# EAGLE design FlightComputer (EAGLE 9.0.1)
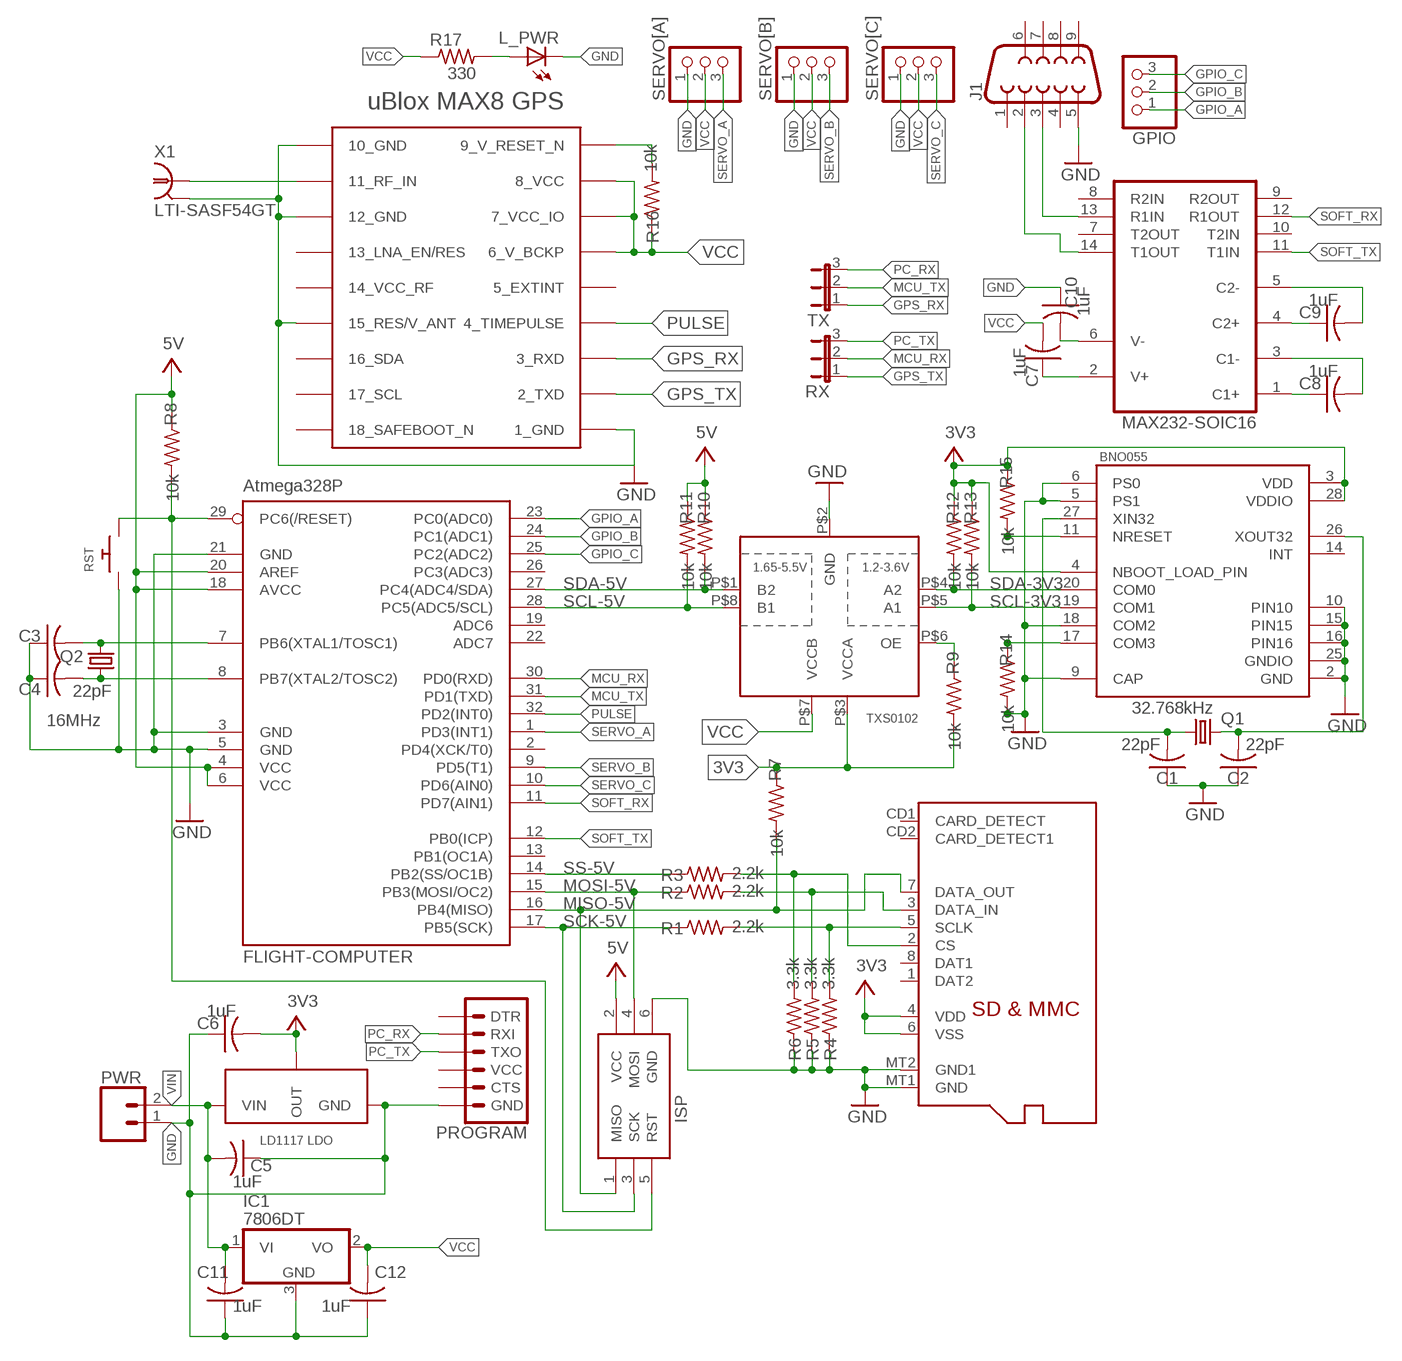
[diagram p0: schematic, sheet 1]

## Parts
BNO055  BNO055  [LGA28R50P4X10_380X520X100]
C1  22pF  C-USC0805  [C0805]
C2  22pF  C-USC0805  [C0805]
C3  22pF  C-USC0805  [C0805]
C4  22pF  C-USC0805  [C0805]
C5  1uF  C-USC0805  [C0805]
C6  1uF  C-USC0805  [C0805]
C7  1uF  C-USC0805  [C0805]
C8  1uF  C-USC0805  [C0805]
C9  1uF  C-USC0805  [C0805]
C10  1uF  C-USC0805  [C0805]
C11  1uF  C-USC0805  [C0805]
C12  1uF  C-USC0805  [C0805]
FLIGHT-COMPUTER  Atmega328P  MEGA8-AI  [TQFP32-08]
GPIO  PINHD-1X3  [1X03]
IC1  7806DT  [TO252]
ISP  AVRISP-BOX  [AVRISP-BOX]
J1  DB9MALE  [DB9_MALE]
L_PWR  LEDSML0805  [SML0805]
MAX232-SOIC16  MAX232ECWE  [SO16L]
PROGRAM  6_PIN_SERIAL_TARGETSILK  [6_PIN_SERIAL_TARGET_SIDE_W_SILK]
PWR  CONN_02  [1X02]
Q1  32.768kHz  CRYSTALHC49S  [HC49/S]
Q2  16MHz  CRYSTALHC49S  [HC49/S]
R1  2.2k  R-US_R0805  [R0805]
R2  2.2k  R-US_R0805  [R0805]
R3  2.2k  R-US_R0805  [R0805]
R4  3.3k  R-US_R0805  [R0805]
R5  3.3k  R-US_R0805  [R0805]
R6  3.3k  R-US_R0805  [R0805]
R7  10k  R-US_R0805  [R0805]
R8  10k  R-US_R0805  [R0805]
R9  10k  R-US_R0805  [R0805]
R10  10k  R-US_R0805  [R0805]
R11  10k  R-US_R0805  [R0805]
R12  10k  R-US_R0805  [R0805]
R13  10k  R-US_R0805  [R0805]
R14  10k  R-US_R0805  [R0805]
R15  10k  R-US_R0805  [R0805]
R16  10k  R-US_R0805  [R0805]
R17  330  R-US_R0805  [R0805]
RST  SWITCH_PUSHBUTTONEVQ-PE  [TACT_PANA-EVQ]
RX  JP2E  [JP2]
SD-CARD  MICROSD  [MICROSD]
SERVO[A]  PINHD-1X3  [1X03]
SERVO[B]  PINHD-1X3  [1X03]
SERVO[C]  PINHD-1X3  [1X03]
TX  JP2E  [JP2]
TXS0102  TXS0102  [VFSOP-8]
U$1  MAX-M8  [MAX-M8]
U$2  LD1117  [LD1117]
X1  LTI-SASF54GT  [LTI-SASF54GT]

## Nets
3V3: BNO055.3(VDD) BNO055.4(NBOOT_LOAD_PIN) BNO055.28(VDDIO) C6.2 R7.1 R9.2 R12.1 R13.1 R15.1 SD-CARD.4(VDD) SD-CARD.6(VSS) TXS0102.P$3(VCCA) U$2.OUT U$2.PAD(OUT)
BNO_RST_3V3: BNO055.11(NRESET) R15.2
GND: BNO055.2(GND) BNO055.5(PS1) BNO055.6(PS0) BNO055.9(CAP) BNO055.10(PIN10) BNO055.15(PIN15) BNO055.16(PIN16) BNO055.18(COM2) BNO055.25(GNDIO) C1.1 C2.1 C3.1 C4.1 C5.1 C6.1 C10.1 C11.1 C12.1 FLIGHT-COMPUTER.3(GND) FLIGHT-COMPUTER.5(GND) FLIGHT-COMPUTER.21(GND) IC1.3(GND) ISP.6(GND) J1.5 L_PWR.C PROGRAM.P$6(GND) PWR.1 R4.1 R5.1 R6.1 R14.2 RST.P$1 SD-CARD.MT1(GND) SD-CARD.MT2(GND1) SERVO[A].1 SERVO[B].1 SERVO[C].1 TXS0102.P$2(GND) U$2.GND
GPIO_A: FLIGHT-COMPUTER.23(PC0(ADC0)) GPIO.1
GPIO_B: FLIGHT-COMPUTER.24(PC1(ADC1)) GPIO.2
GPIO_C: FLIGHT-COMPUTER.25(PC2(ADC2)) GPIO.3
GPS_RX: TX.1 U$1.3_RXD
GPS_TX: RX.1 U$1.2_TXD
MCU_RX: FLIGHT-COMPUTER.30(PD0(RXD)) RX.2
MCU_TX: FLIGHT-COMPUTER.31(PD1(TXD)) TX.2
MISO-5V: FLIGHT-COMPUTER.16(PB4(MISO)) ISP.1(MISO) R7.2 SD-CARD.7(DATA_OUT)
MOSI-5V: FLIGHT-COMPUTER.15(PB3(MOSI/OC2)) ISP.4(MOSI) R2.1
N$1: C4.2 FLIGHT-COMPUTER.8(PB7(XTAL2/TOSC2)) Q2.1
N$2: C3.2 FLIGHT-COMPUTER.7(PB6(XTAL1/TOSC1)) Q2.2
N$3: R9.1 TXS0102.P$6(OE)
N$4: U$1.11_RF_IN X1.1
N$5: BNO055.17(COM3) R14.1
N$6: BNO055.27(XIN32) C1.2 Q1.1
N$7: R16.2 U$1.9_RESET_N(9_V_RESET_N)
N$8: FLIGHT-COMPUTER.29(PC6(/RESET)) ISP.5(RST) R8.2 RST.P$2
N$9: BNO055.26(XOUT32) C2.2 Q1.2
N$10: J1.3 MAX232-SOIC16.13(R1IN)
N$11: U$1.1_GND U$1.10_GND U$1.12_GND U$1.15_V_ANT/RESERVED(15_RES/V_ANT) X1.2 X1.3 X1.4 X1.5
N$14: J1.2 MAX232-SOIC16.14(T1OUT)
N$15: L_PWR.A R17.2
N$16: C7.1 MAX232-SOIC16.2(V+)
N$17: C8.1 MAX232-SOIC16.1(C1+)
N$18: C8.2 MAX232-SOIC16.3(C1-)
N$19: C9.1 MAX232-SOIC16.4(C2+)
N$20: C9.2 MAX232-SOIC16.5(C2-)
N$21: C10.2 MAX232-SOIC16.6(V-)
PC_RX: PROGRAM.P$3(RXI) TX.3
PC_TX: PROGRAM.P$2(TXO) RX.3
PULSE: FLIGHT-COMPUTER.32(PD2(INT0)) U$1.4_TIMEPULSE
SCK-5V: FLIGHT-COMPUTER.17(PB5(SCK)) ISP.3(SCK) R1.1
SCL-3V3: BNO055.19(COM1) R13.2 TXS0102.P$5(A1)
SCL-5V: FLIGHT-COMPUTER.28(PC5(ADC5/SCL)) R11.2 TXS0102.P$8(B1)
SD_CS: R3.2 R6.2 SD-CARD.2(CS)
SD_MOSI: R2.2 R5.2 SD-CARD.3(DATA_IN)
SD_SCK: R1.2 R4.2 SD-CARD.5(SCLK)
SDA-3V3: BNO055.20(COM0) R12.2 TXS0102.P$4(A2)
SDA-5V: FLIGHT-COMPUTER.27(PC4(ADC4/SDA)) R10.2 TXS0102.P$1(B2)
SERVO_A: FLIGHT-COMPUTER.1(PD3(INT1)) SERVO[A].3
SERVO_B: FLIGHT-COMPUTER.9(PD5(T1)) SERVO[B].3
SERVO_C: FLIGHT-COMPUTER.10(PD6(AIN0)) SERVO[C].3
SOFT_RX: FLIGHT-COMPUTER.11(PD7(AIN1)) MAX232-SOIC16.12(R1OUT)
SOFT_TX: FLIGHT-COMPUTER.12(PB0(ICP)) MAX232-SOIC16.11(T1IN)
SS-5V: FLIGHT-COMPUTER.14(PB2(SS/OC1B)) R3.1
VCC: C7.2 C12.2 FLIGHT-COMPUTER.4(VCC) FLIGHT-COMPUTER.6(VCC) FLIGHT-COMPUTER.18(AVCC) FLIGHT-COMPUTER.20(AREF) IC1.2(VO) ISP.2(VCC) R8.1 R10.1 R11.1 R16.1 R17.1 SERVO[A].2 SERVO[B].2 SERVO[C].2 TXS0102.P$7(VCCB) U$1.6_V_BCKP U$1.7_VCC_IO U$1.8_VCC ; supply symbol labelled 5V
VIN: C5.2 C11.2 IC1.1(VI) PWR.2 U$2.IN(VIN)
Unconnected: BNO055.14(INT) FLIGHT-COMPUTER.2(PD4(XCK/T0)) FLIGHT-COMPUTER.13(PB1(OC1A)) FLIGHT-COMPUTER.19(ADC6) FLIGHT-COMPUTER.22(ADC7) FLIGHT-COMPUTER.26(PC3(ADC3)) J1.1 J1.4 J1.6 J1.7 J1.8 J1.9 MAX232-SOIC16.7(T2OUT) MAX232-SOIC16.8(R2IN) MAX232-SOIC16.9(R2OUT) MAX232-SOIC16.10(T2IN) PROGRAM.P$1(DTR) PROGRAM.P$4(VCC) PROGRAM.P$5(CTS) SD-CARD.1(DAT2) SD-CARD.8(DAT1) SD-CARD.CD1(CARD_DETECT) SD-CARD.CD2(CARD_DETECT1) U$1.5_EXTINT U$1.13_LNA_EN(13_LNA_EN/RES) U$1.14_VCC_RF U$1.16_SDA U$1.17_SCL U$1.18_SAFEBOOT_N

## Notes on the sheet
- uBlox MAX8 GPS

## Power pins joined to a net without a drawn wire
GND: MAX232-SOIC16.15(GND)
VCC: MAX232-SOIC16.16(VCC)

## Library data of the parts
BNO055 = BNO055:BNO055: BNO055 9-axis Absolute Orientation Sensor ( SiP ) w/Sensors and Sensor Fusion; AVAILABILITY: Good; DESCRIPTION: BNO055 9-axis Absolute Orientation Sensor _ SiP _ w/Sensors and Sensor Fusion; MF: Bosch; MP: BNO055; PACKAGE: LGA-28 Bosch; PRICE: 8.04 USD
C1-C12 = adafruit:C-US: CAPACITOR, American symbol
FLIGHT-COMPUTER = atmel:MEGA8: MICROCONTROLLER 8 Kbytes FLASH, 1 kbytes SRAM, 512 bytes EEPROM, USART, 6-channel 10 bit ADC, 2-channel 8 bit ADC Pin compatible with Atmega48, ATMega88, ATMega168 Source: avr.lbr; MPN: ATMEGA8-16AU; OC_FARNELL: 9171371; OC_NEWARK: 73M8863
GPIO SERVO[A] SERVO[B] SERVO[C] = adafruit:PINHD-1X3: PIN HEADER
IC1 = adafruit:78*: Positive VOLTAGE REGULATOR Added bigger pads to the TO-92 package
ISP = adafruit:AVRISP: AVR ISP HEADER Standard 6 pin header for AVR programming
J1 = SparkFun-Connectors:DB9: DB9 Connector Standard DB9 (D-Sub 9) serial connector. Can be used for CAN bus as well as RS485 and RS232. Footprint production proven. Here is the female version connector we sell at SparkFun: 9 Pin Female Serial Connector - PCB Mount <https://www.sparkfun.com/products/429> (PRT-00429) This connector has been used on the following SparkFun products: SparkFun RS232 Shifter - SMD <https://www.sparkfun.com/products/449> (PRT-00449) SparkFun RS232 Shifter SMD (No DB9) <https://www.sparkfun.com/products/8780> (PRT-08780); PROD_ID: CONN-09904
L_PWR = led:LED: LED OSRAM: - CHIPLED LG R971, LG N971, LY N971, LG Q971, LY Q971, LO R971, LY R971 LH N974, LH R974 LS Q976, LO Q976, LY Q976 LO Q996 - Hyper CHIPLED LW Q18S LB Q993, LB Q99A, LB R99A - SideLED LS A670, LO A670, LY A670, LG A670, LP A670 LB A673, LV A673, LT A673, LW A673 LH A674 LY A675 LS A676, LA A676, LO A676, LY A676, LW A676 LS A679, LY A679, LG A679 - Hyper Micro SIDELED® LS Y876, LA Y876, LO Y876, LY Y876 LT Y87S - SmartLED LW L88C, LW L88S LB L89C, LB L89S, LG L890 LS L89K, LO L89K, LY L89K LS L896, LA L896, LO L896, LY L896 - TOPLED LS T670, LO T670, LY T670, LG T670, LP T670 LSG T670, LSP T670, LSY T670, LOP T670, LYG T670 LG T671, LOG T671, LSG T671 LB T673, LV T673, LT T673, LW T673 LH T674 LS T676, LA T676, LO T676, LY T676, LB T676, LH T676, LSB T676, LW T676 LB T67C, LV T67C, LT T67C, LS T67K, LO T67K, LY T67K, LW E67C LS E67B, LA E67B, LO E67B, LY E67B, LB E67C, LV E67C, LT E67C LW T67C LS T679, LY T679, LG T679 LS T770, LO T770, LY T770, LG T770, LP T770 LB T773, LV T773, LT T773, LW T773 LH T774 LS E675, LA E675, LY E675, LS T675 LS T776, LA T776, LO T776, LY T776, LB T776 LHGB T686 LT T68C, LB T68C - Hyper Mini TOPLED® LB M676 - Mini TOPLED Santana® LG M470 LS M47K, LO M47K, LY M47K Source: http://www.osram.convergy.de LUXEON: - LUMILED® LXK2-PW12-R00, LXK2-PW12-S00, LXK2-PW14-U00, LXK2-PW14-V00 LXK2-PM12-R00, LXK2-PM12-S00, LXK2-PM14-U00 LXK2-PE12-Q00, LXK2-PE12-R00, LXK2-PE12-S00, LXK2-PE14-T00, LXK2-PE14-U00 LXK2-PB12-K00, LXK2-PB12-L00, LXK2-PB12-M00, LXK2-PB14-N00, LXK2-PB14-P00, LXK2-PB14-Q00 LXK2-PR12-L00, LXK2-PR12-M00, LXK2-PR14-Q00, LXK2-PR14-R00 LXK2-PD12-Q00, LXK2-PD12-R00, LXK2-PD12-S00 LXK2-PH12-R00, LXK2-PH12-S00 LXK2-PL12-P00, LXK2-PL12-Q00, LXK2-PL12-R00 Source: www.luxeon.com KINGBRIGHT: KA-3528ASYC Source: www.kingbright.com
MAX232-SOIC16 = maxim:MAX232ECWE: RS232 TRANSCEIVER; MF: MAXIM; MPN: MAX232ECWE+; OC_FARNELL: 9724435; OC_NEWARK: 67K4440
PROGRAM = SparkFun-Connectors:6_PIN_SERIAL_TARGET: 6-pin header connection for use with the "FTDI BASIC" pinout - TARGET SIDE. Also known as "Arduino Serial Program Header". It is used to mate with our FTDI Basic serial programmers using the Arduino IDE. Note, this device has "TARGET" in the name. It is intended to be used on a design that contains a target micro-controller that you wish to program. The "sister" device, named "CABLE" is inteneded to be used on a design that usually lives on the end of your USB cable and prvides the converter chip (FTDI232 or FTDI231x) to commnicate serial RX/TX. You can populate with some of these: Break Away Headers - Straight <https://www.sparkfun.com/products/116> (PRT-00116) For reference (or to suit your programming needs) check out these designs: SparkFun FTDI Basic Breakout - 5V <https://www.sparkfun.com/products/9716> (DEV-09716) SparkFun FTDI Basic Breakout - 3.3V <https://www.sparkfun.com/products/9873> (DEV-09873) SparkFun FTDI SmartBasic <https://www.sparkfun.com/products/12935> (DEV-12935) SparkFun Beefy 3 - FTDI Basic Breakout <https://www.sparkfun.com/products/13746> (DEV-13746)
PWR = SparkFun-Connectors:CONN_02: Multi connection point. Often used as Generic Header-pin footprint for 0.1 inch spaced/style header connections On any of the 0.1 inch spaced packages, you can populate with these: Break Away Headers - Straight <https://www.sparkfun.com/products/116> (PRT-00116) Break Away Male Headers - Right Angle <https://www.sparkfun.com/products/553> (PRT-00553) Female Headers <https://www.sparkfun.com/products/115> (PRT-00115) Break Away Headers - Machine Pin <https://www.sparkfun.com/products/117> (PRT-00117) Break Away Female Headers - Swiss Machine Pin <https://www.sparkfun.com/products/743> (PRT-00743) For SCREWTERMINALS and SPRING TERMINALS visit here: Screw Terimnals on SparkFun.com <https://www.sparkfun.com/search/results?term=Screw+Terminals> (5mm/3.5mm/2.54mm spacing) This device is also useful as a general connection point to wire up your design to another part of your project. Our various solder wires solder well into these plated through hole pads. Hook-Up Wire - Assortment (Stranded, 22 AWG) <https://www.sparkfun.com/products/11375> (PRT-11375) Hook-Up Wire - Assortment (Solid Core, 22 AWG) <https://www.sparkfun.com/products/11367> (PRT-11367) View the entire wire category on our website here <https://www.sparkfun.com/categories/141> Special notes: Molex polarized connector foot print use with: PRT-08233 with associated crimp pins and housings. 2.54_SCREWTERM for use with PRT-10571. 3.5mm Screw Terminal footprints for PRT-08084 5mm Screw Terminal footprints for use with PRT-08432
Q1 Q2 = adafruit:CRYSTAL: CRYSTAL; OC_FARNELL: 1667008; OC_NEWARK: unknown
R1-R17 = adafruit:R-US_: RESISTOR, American symbol
RST = adafruit:SWITCH_PUSHBUTTON: Buttons SOFTTOUCHSMD_SJ - Soft touch temporary push button (Super Junk Akihabara) Compatible with SKPMANE010 [Mouser: 688-SKPMAN] C&K_KSS = Digikey: KSS221GLFS
RX TX = jumper:JP2E: JUMPER
SD-CARD = adafruit:MICROSD: Micro-SD / Transflash card holder with SPI pinout For the 3M # 2908-05WB-MG and/or 4UCON #19656 push-push type
TXS0102 = adafruit:TXS0102: 2-Bit Bi-Directional Level Shifter (I2C, etc.) Designed for I2C devices and has internal pullups. Not to be confused with TXB010x series. 1.2V-3.6V (VCCA) to 1.65V-5.5V (VCCB) bi-directional level shifter with auto direction sensing. Max data rate - 24Mbps (Push Pull), 2Mbps (Open Drain) Digikey: 296-21931-1-ND
U$1 = ubloxLib:MAX-M8: u-blox MAX GNSS module
U$2 = ReconfigBoard_Parts:LD1117: StMicroeletronics LD1117; in DPAK Configuration. Various Fixed Voltage Levels, LDO Type. By Kenneth Vorseth.
X1 = con-coax:LTI-SASF54GT: SMA vertical PCB thrue hole jack Source: Lighthorse Technologies, inc. SASF54GT.pdf; OC_FARNELL: unknown; OC_NEWARK: unknown

## Board
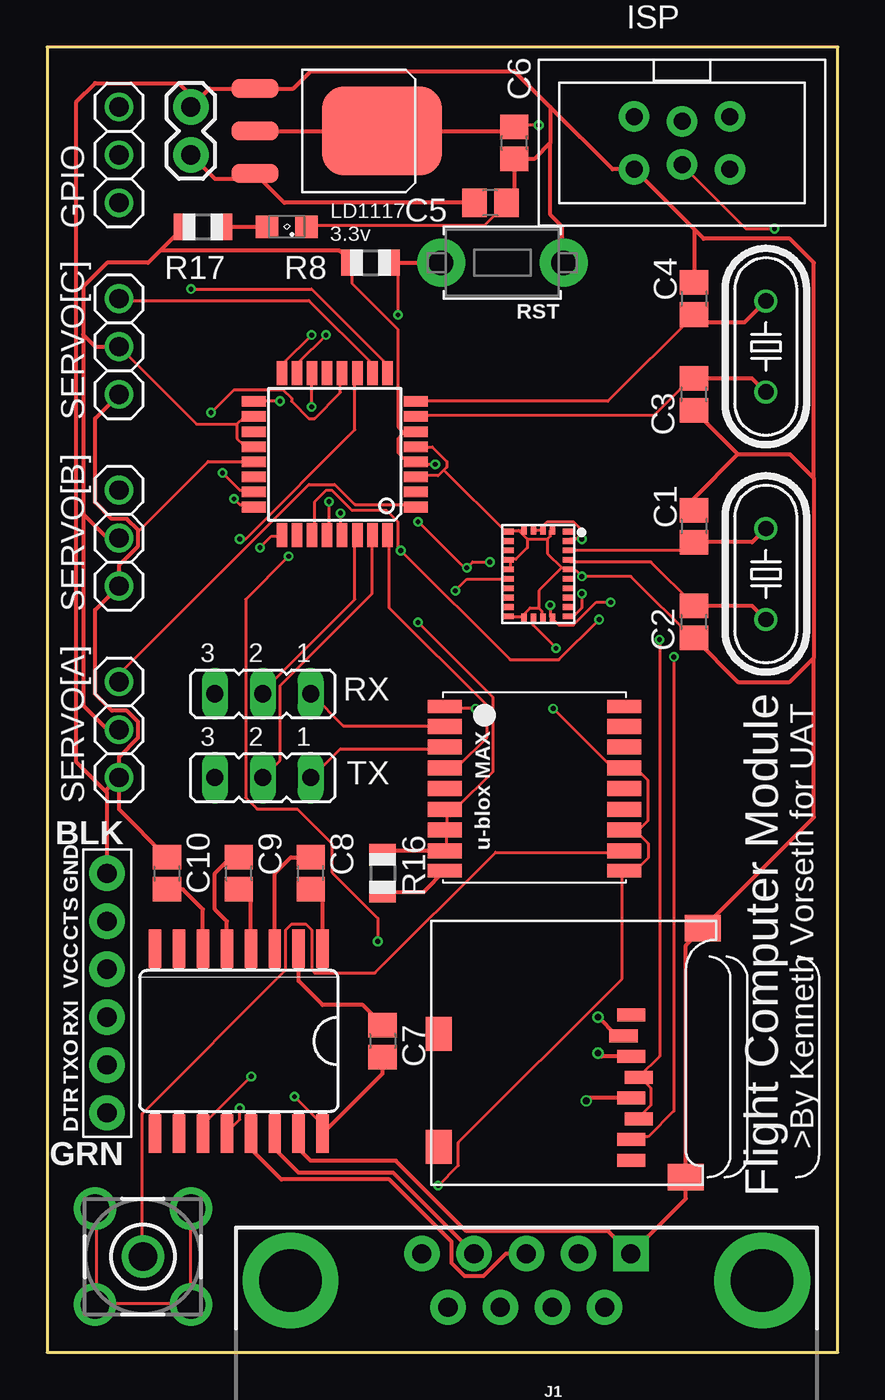
[diagram p1: board, top side]
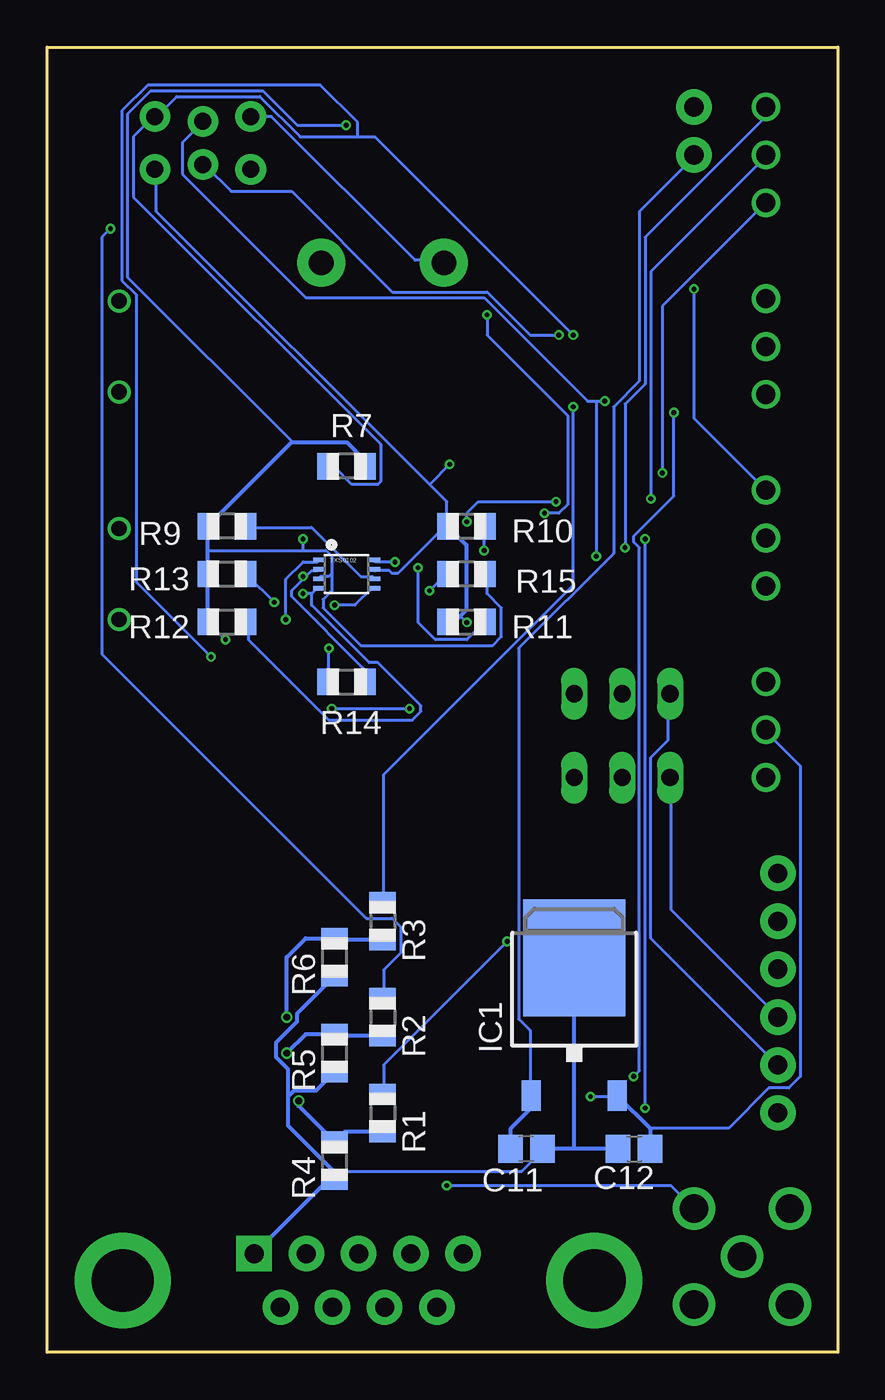
[diagram p2: board, bottom side, seen from below]

Size 41.91 x 69.22 mm. Coordinates in mm from the lower left corner, seen from the top.
Outline: 0,0 41.91,0 41.91,69.22 0,69.22 0,0
Copper layers (1*16): Top 0.035mm / dielectric 1.5mm / Bottom 0.035mm
Design rules "default *": minimum track width 6mil, minimum drill 10mil, track to track 6mil, track to pad 6mil, pad to pad 6mil, via to via 6mil, smd to smd 6mil, copper to edge 40mil, drill to drill 10mil, minimum pad ring 5mil, minimum via ring 5mil, stop-mask expansion 4mil, vias tented up to drill 0mil, thermal gap 10mil

### Footprints (pad centres in the part's own frame; a part is rotated, then mirrored left to right if it is on the bottom)
LGA28R50P4X10_380X520X100 = smd 0.3 x 0.525: 1 -2.25,1.562; 6 -2.25,-1.562; 7 -1.75,-1.562; 8 -1.25,-1.562; 9 -0.75,-1.562; 10 -0.25,-1.562; 11 0.25,-1.562; 12 0.75,-1.562; 13 1.25,-1.562; 14 1.75,-1.562; 15 2.25,-1.562; 20 2.25,1.562; 21 1.75,1.562; 22 1.25,1.562; 23 0.75,1.562; 24 0.25,1.562; 25 -0.25,1.562; 26 -0.75,1.562; 27 -1.25,1.562; 28 -1.75,1.562 | smd 0.425 x 0.3: 2 -2.312,0.75; 3 -2.312,0.25; 4 -2.312,-0.25; 5 -2.312,-0.75; 16 2.312,-0.75; 17 2.312,-0.25; 18 2.312,0.25; 19 2.312,0.75
C0805 = smd 1.3 x 1.5: 1 -0.85,0; 2 0.85,0
TQFP32-08 = smd 1.27 x 0.559: 1 -4.293,2.8; 2 -4.293,2; 3 -4.293,1.2; 4 -4.293,0.4; 5 -4.293,-0.4; 6 -4.293,-1.2; 7 -4.293,-2; 8 -4.293,-2.8; 17 4.293,-2.8; 18 4.293,-2; 19 4.293,-1.2; 20 4.293,-0.4; 21 4.293,0.4; 22 4.293,1.2; 23 4.293,2; 24 4.293,2.8 | smd 0.559 x 1.27: 9 -2.8,-4.293; 10 -2,-4.293; 11 -1.2,-4.293; 12 -0.4,-4.293; 13 0.4,-4.293; 14 1.2,-4.293; 15 2,-4.293; 16 2.8,-4.293; 25 2.8,4.293; 26 2,4.293; 27 1.2,4.293; 28 0.4,4.293; 29 -0.4,4.293; 30 -1.2,4.293; 31 -2,4.293; 32 -2.8,4.293
1X03 = drill 1.016: 1 -2.54,0; 2 0,0; 3 2.54,0
TO252 = smd 1 x 1.6: 1 -2.28,-4.8; 2 2.28,-4.8 | smd 5.4 x 6.2: 3 0,2.5
AVRISP-BOX = drill 0.9 pad 1.626: 1 -1.397,2.54; 2 1.397,2.54; 3 -1.143,0; 4 1.143,0; 5 -1.397,-2.54; 6 1.397,-2.54
DB9_MALE = drill 1.016 pad 1.88: 1 5.54,-1.42; 2 2.77,-1.42; 3 0,-1.42; 4 -2.77,-1.42; 6 4.15,1.42; 7 1.38,1.42; 8 -1.38,1.42; 9 -4.15,1.42 | drill 1.016 pad 1.88 square: 5 -5.54,-1.42 | drill 3.302 pad 5.08: G1 -12.5,0; G2 12.5,0
SML0805 = smd 1.2 x 1.2: A 1.05,0; C -1.05,0
SO16L = smd 0.66 x 2.032: 1 -4.445,-4.902; 2 -3.175,-4.902; 3 -1.905,-4.902; 4 -0.635,-4.902; 5 0.635,-4.902; 6 1.905,-4.902; 7 3.175,-4.902; 8 4.445,-4.902; 9 4.445,4.902; 10 3.175,4.902; 11 1.905,4.902; 12 0.635,4.902; 13 -0.635,4.902; 14 -1.905,4.902; 15 -3.175,4.902; 16 -4.445,4.902
6_PIN_SERIAL_TARGET_SIDE_W_SILK = drill 1.016 pad 1.88: P$1 -6.35,0; P$2 -3.81,0; P$3 -1.27,0; P$4 1.27,0; P$5 3.81,0; P$6 6.35,0
1X02 = drill 1.016 pad 1.88: 1 0,0; 2 2.54,0
HC49/S = drill 0.813: 1 -2.413,0; 2 2.413,0
R0805 = smd 1.1 x 1.4: 1 -1,0; 2 1,0
TACT_PANA-EVQ = drill 1.3 pad 2.54: P$1 -3.25,0; P$2 3.25,0
JP2 = drill 0.914 long: 1 -2.54,0; 2 0,0; 3 2.54,0
MICROSD = smd 0.7 x 1.5: 1 9,-10.64; 2 7.9,-10.24; 3 6.8,-10.64; 4 5.7,-11.04; 5 4.6,-10.64; 6 3.5,-11.04; 7 2.4,-10.64; 8 1.3,-10.64 | smd 1.8 x 1.4: CD1 2,-0.44; CD2 8,-0.44 | smd 1.4 x 1.9: MT1 0.4,-13.54; MT2 13.6,-14.44
VFSOP-8 = smd 0.25 x 0.65: P$1 -0.75,-1.45; P$2 -0.25,-1.45; P$3 0.25,-1.45; P$4 0.75,-1.45; P$5 0.75,1.45; P$6 0.25,1.45; P$7 -0.25,1.45; P$8 -0.75,1.45
MAX-M8 = smd 1.8 x 0.7: 1_GND 4.95,-4.4; 9_RESET_N 4.95,4.3; 10_GND -4.55,4.3; 18_SAFEBOOT_N -4.55,-4.4 | smd 1.8 x 0.8: 2_TXD 4.95,-3.35; 3_RXD 4.95,-2.25; 4_TIMEPULSE 4.95,-1.15; 5_EXTINT 4.95,-0.05; 6_V_BCKP 4.95,1.05; 7_VCC_IO 4.95,2.15; 8_VCC 4.95,3.25; 11_RF_IN -4.55,3.25; 12_GND -4.55,2.15; 13_LNA_EN -4.55,1.05; 14_VCC_RF -4.55,-0.05; 15_V_ANT/RESERVED -4.55,-1.15; 16_SDA -4.55,-2.25; 17_SCL -4.55,-3.35
LD1117 = smd 1 x 2.5: GND -2.25,-5.5; IN 2.25,-5.5; OUT 0,-5.5 | smd 4.7 x 6.35: PAD 0,1.25
LTI-SASF54GT = drill 1.5 pad 2.2: 1 0,0; 2 -2.54,2.54; 3 2.54,2.54; 4 2.54,-2.54; 5 -2.54,-2.54

### Placement (x,y rotation side)
BNO055  26.04,41.27 270 top
C1  34.29,43.81 270 top
C2  34.29,38.73 90 top
C3  34.29,50.8 90 top
C4  34.29,55.88 270 top
C5  23.5,60.96 180 top
C6  24.77,64.14 90 top
C7  17.78,16.51 270 top
C8  13.97,25.4 90 top
C9  10.16,25.4 90 top
C10  6.35,25.4 270 top
C11  16.51,10.79 180 bottom
C12  10.79,10.79 0 bottom
FLIGHT-COMPUTER  15.24,47.62 180 top
GPIO  3.81,63.5 90 top
IC1  13.97,18.41 0 bottom
ISP  33.66,64.14 270 top
J1  25.4,3.81 180 top
L_PWR  12.7,59.69 180 top
MAX232-SOIC16  10.16,16.51 180 top
PROGRAM  3.17,19.05 90 top
PWR  7.62,66.04 270 top
Q1  38.1,41.27 270 top
Q2  38.1,53.34 270 top
R1  24.13,12.7 270 bottom
R2  24.13,17.78 270 bottom
R3  24.13,22.86 270 bottom
R4  26.67,10.16 90 bottom
R5  26.67,15.88 90 bottom
R6  26.67,20.95 90 bottom
R7  26.04,46.99 180 bottom
R8  17.14,57.78 0 top
R9  32.38,43.81 180 bottom
R10  19.68,43.81 0 bottom
R11  19.68,38.73 0 bottom
R12  32.38,38.73 0 bottom
R13  32.38,41.27 0 bottom
R14  26.04,35.56 0 bottom
R15  19.68,41.27 180 bottom
R16  17.78,25.4 270 top
R17  8.26,59.69 0 top
RST  24.13,57.78 180 top
RX  11.43,34.92 180 top
SD-CARD  20.32,8.89 90 top
SERVO[A]  3.81,33.02 90 top
SERVO[B]  3.81,43.18 90 top
SERVO[C]  3.81,53.34 90 top
TX  11.43,30.48 180 top
TXS0102  26.04,41.27 270 bottom
U$1  26.04,29.84 180 top
U$2  16.51,64.77 270 top
X1  5.08,5.08 0 top

### Tracks (layer width: path | path; a pad name or v marks a point on that pad's centre or on a via)
3V3  (via drill 0.25)
  Top 0.152: 31.39,14.63 32,14.02 32,13.11 31.39,12.5 SD-CARD.6 | BNO055.4 25.91,43.59 26.21,43.59 BNO055.3 26.21,43.74 26.52,44.04 27.89,44.04 28.19,43.74 28.19,43.28 | 28.19,43.28 28.04,43.13 27.74,43.13 BNO055.28 | v28.35,43.13 28.19,43.28 | 31.39,14.63 32.46,15.7 v32.46,37.8 | 31.39,14.63 SD-CARD.4 | v26.06,65.08 24.84,65.08 C6.2
  Top 0.203: U$2.OUT U$2.PAD 24.55,64.77 C6.2
  Bottom 0.152: 26.82,41.3 26.98,41.15 27.43,41.15 TXS0102.P$3 | 26.82,41.3 26.82,42.22 27.13,42.52 28.35,42.52 | 33.38,42.52 28.35,42.52 | 26.82,41.3 26.82,40.39 27.28,39.93 27.28,39.47 25.3,37.49 18.29,37.49 17.83,37.95 17.83,39.47 18.59,40.23 18.59,41.15 R15.1 | 28.35,42.52 v28.35,43.13 | v32.46,37.8 33.38,38.71 R12.1 | v26.06,65.08 28.65,65.08 30.48,66.9 36.42,66.9 37.64,65.68 37.64,57 28.96,48.31 28.94,48.26
  Bottom 0.203: R12.1 R13.1 33.38,42.52 R9.2 28.94,48.26 26.04,48.26 25.04,47.26 R7.1
BNO_RST_3V3  (via drill 0.25)
  Top 0.152: v21.64,40.39 22.25,41 24.38,41 BNO055.11
  Bottom 0.152: v21.64,40.39 20.73,41.3 R15.2
GND  (via drill 0.25)
  Top 0.152: 21.03,46.79 21.18,46.94 21.18,47.24 20.42,48.01 19.66,48.01 FLIGHT-COMPUTER.5 | 21.03,46.79 20.73,46.48 19.66,46.48 FLIGHT-COMPUTER.3 | 25.15,39.01 24.54,39.01 BNO055.15 | 26.06,39.47 26.21,39.32 26.21,39.01 BNO055.18 | 26.06,39.47 25.6,39.47 25.15,39.01 | 25.15,39.01 BNO055.16 | BNO055.10 24.54,41.6 24.54,41.91 BNO055.9 24.54,42.06 24.84,42.06 25.45,42.67 25.45,43.13 | 24.99,43.59 24.54,43.59 BNO055.6 24.38,43.43 21.03,46.79 | 24.99,43.59 25.15,43.59 BNO055.5 | 26.52,43.13 26.67,43.28 26.67,43.59 BNO055.2 | 25.45,43.13 26.52,43.13 | 24.99,43.59 25.45,43.13 | 27.28,41.6 27.58,41.6 BNO055.25 27.74,41.45 28.04,41.45 v28.35,41.15 30.94,41.15 34.29,37.8 C2.1 | 27.28,41.6 26.52,42.37 26.52,43.13 | 26.06,39.47 26.06,40.39 27.28,41.6 | L_PWR.C 13.87,59.74 23.16,59.74 24.38,60.96 C5.1 | FLIGHT-COMPUTER.21 10.82,47.24 8.53,47.24 4.88,43.59 4.83,43.59
  Top 0.203: C10.1 3.81,28.79 SERVO[A].1 | C5.1 24.77,61.38 C6.1 25.82,63.28 26.67,64.14 | PROGRAM.P$6 3.17,29.68 3.09,29.76 | 3.09,29.76 1.55,31.3 1.55,66.32 2.54,67.31 6.99,67.31 7.62,66.67 PWR.1 8.6,67.02 U$2.GND 13.04,67.02 13.97,67.94 24.77,67.94 26.67,66.04 | 26.67,66.04 26.67,64.14 | 3.09,29.76 SERVO[A].1 | SERVO[A].1 3.81,31.58 4.83,32.6 4.83,33.44 4.23,34.04 3.43,34.04 2.54,34.92 2.54,39.37 SERVO[B].1 3.81,41.74 4.83,42.76 4.83,43.59 4.83,43.6 4.23,44.2 3.43,44.2 2.54,45.09 2.54,49.53 SERVO[C].1 | RST.P$1 27.3,57.86 27.3,59.69 26.67,60.33 26.67,64.14 | 34.29,59.56 ISP.6 29.97,62.74 26.67,66.04 | 34.29,59.56 C4.1 | C2.1 36.62,35.56 39.37,35.56 40.64,36.83 | C3.1 36.62,47.62 | 36.62,47.62 39.37,47.62 40.64,46.35 | 40.64,46.35 40.64,36.83 | 36.62,47.62 34.29,45.3 C1.1 | 40.64,46.35 40.64,57.78 39.37,59.05 34.8,59.05 34.29,59.56 | 40.64,36.83 40.64,28.37 SD-CARD.MT2 33.86,21.59 SD-CARD.MT1 33.86,8.15 J1.5 29.75,6.42 22.23,6.42 18.49,10.16 13.97,10.16 13.34,10.79 MAX232-SOIC16.15
  Bottom 0.152: 28.35,41 28.96,40.39 28.96,40.08 25.15,36.27 25.15,35.66 R14.2 | 28.35,41 27.89,41.45 27.58,41.45 TXS0102.P$2 | v28.35,41.15 28.35,41 | C11.1 15.7,10.67 16.76,9.6 26.67,9.6 R4.1
  Bottom 0.203: J1.5 27.01,9.16 R4.1 26.67,9.55 29.13,12.01 29.13,13.56 | 29.13,13.56 28.8,13.89 27.65,13.89 R5.1 | R6.1 28.65,17.97 28.65,17.55 29.77,16.44 29.77,15.64 29.13,15.01 29.13,13.56 | C12.1 13.97,10.79 | 13.97,10.79 C11.1 | 13.97,10.79 IC1.3
GPIO_A  (via drill 0.25)
  Top 0.152: v9.3,46.63 10.21,45.72 10.82,45.72 FLIGHT-COMPUTER.23
  Bottom 0.152: v9.3,46.63 9.3,55.47 GPIO.1
GPIO_B  (via drill 0.25)
  Top 0.152: v9.91,45.26 10.21,44.96 10.82,44.96 FLIGHT-COMPUTER.24
  Bottom 0.152: v9.91,45.26 9.91,57.3 3.81,63.4 GPIO.2
GPIO_C  (via drill 0.25)
  Top 0.152: v11.28,42.67 11.89,43.28 12.34,43.28 FLIGHT-COMPUTER.25
  Bottom 0.152: v11.28,42.67 11.28,50.29 10.21,51.36 10.21,59.13 3.81,65.53 GPIO.3
GPS_RX
  Top 0.152: U$1.3_RXD 21.03,32 15.54,32 14.02,30.48 TX.1
GPS_TX
  Top 0.152: U$1.2_TXD 21.03,33.22 15.7,33.22 14.02,34.9 RX.1
MCU_RX
  Top 0.152: FLIGHT-COMPUTER.30 16.31,43.28 16.31,39.93 11.43,35.05 RX.2
MCU_TX
  Top 0.152: TX.2 12.34,31.39 12.34,35.36 17.22,40.23 17.22,43.28 FLIGHT-COMPUTER.31
MISO-5V  (via drill 0.25)
  Top 0.152: v14.02,53.95 12.5,52.43 12.5,51.97 FLIGHT-COMPUTER.16 | v33.22,36.88 33.22,12.8 31.85,11.43 31.09,11.43 SD-CARD.7
  Bottom 0.152: v14.02,53.95 24.54,64.47 25.45,64.47 | 25.45,64.47 28.5,64.47 30.63,66.6 35.05,66.6 36.12,65.53 ISP.1 36.27,65.53 37.34,64.47 37.34,61.27 24.23,48.16 24.23,46.18 24.38,46.02 25.76,46.02 26.67,46.94 26.98,46.94 R7.2 | v33.22,36.88 37.19,40.84 37.19,56.08 37.95,56.84 37.95,65.84 36.58,67.21 27.43,67.21 25.45,65.23 25.45,64.47
MOSI-5V  (via drill 0.25)
  Top 0.152: v14.78,53.95 13.26,52.43 13.26,51.97 FLIGHT-COMPUTER.15 | v38.56,59.59 37.03,59.59 33.68,62.94 ISP.4
  Bottom 0.152: v14.78,53.95 16.31,53.95 18.59,56.24 23.62,56.24 28.96,61.57 32.16,61.57 33.53,62.94 ISP.4 | v38.56,59.59 39.01,59.13 39.01,37.03 24.99,23.01 23.62,23.01 23.16,22.55 23.16,21.18 24.08,20.27 24.08,18.9 R2.1
N$1
  Top 0.152: FLIGHT-COMPUTER.8 19.66,50.44 29.72,50.44 34.29,55.02 C4.2
  Top 0.203: Q2.1 36.96,54.61 34.71,54.61 C4.2
N$2
  Top 0.152: FLIGHT-COMPUTER.7 19.66,49.68 32.16,49.68 33.98,51.51 34.29,51.51 C3.2
  Top 0.203: Q2.2 37.38,51.65 C3.2
N$3
  Bottom 0.152: TXS0102.P$6 24.69,41.15 25.3,41.15 27.89,43.74 31.24,43.74 R9.1
N$4
  Top 0.152: U$1.11_RF_IN 30.48,26.52 23.77,26.52 17.37,20.12 14.17,20.12 14.02,20.27 14.02,22.4 13.72,22.71 12.95,22.71 12.65,22.4 12.65,20.27 5.03,12.65 5.03,5.18 X1.1
N$5  (via drill 0.25)
  Top 0.152: v26.98,37.34 25.76,38.56 25.76,38.86 BNO055.17
  Bottom 0.152: v26.98,37.34 26.98,35.66 R14.1
N$6
  Top 0.152: BNO055.27 27.74,42.52 33.98,42.52 34.29,42.82 C1.2
  Top 0.203: Q1.1 37.38,42.97 C1.2
N$7
  Top 0.203: U$1.9_RESET_N 19.94,24.4 R16.2
N$8  (via drill 0.25)
  Top 0.152: v15.54,44.5 15.54,43.43 FLIGHT-COMPUTER.29 | v18.59,55.02 18.59,57.76 R8.2
  Top 0.203: R8.2 RST.P$2
  Bottom 0.152: v15.54,44.5 14.78,44.5 14.33,44.96 14.33,49.68 18.59,53.95 v18.59,55.02 | ISP.5 30.02,65.53 22.4,57.91 21.03,57.91 RST.P$2
N$9
  Top 0.152: BNO055.26 27.74,41.91 32,41.91 34.29,39.62 C2.2
  Top 0.203: Q1.2 37.38,39.59 C2.2
N$10
  Top 0.203: J1.3 24.32,5.23 23.12,4.04 22.14,4.04 21.44,4.74 21.44,5.87 18.14,9.17 12.42,9.17 10.79,10.79 MAX232-SOIC16.13
N$11  (via drill 0.25)
  Top 0.152: 31.24,27.58 31.85,26.98 31.85,26.21 31.24,25.6 30.63,25.6 U$1.10_GND 30.48,25.45 30.48,19.81 21.79,11.12 21.79,9.91 v20.73,8.84 | 31.24,27.58 30.63,27.58 U$1.12_GND 31.24,27.58 | 31.24,27.58 31.85,28.19 31.85,30.33 31.24,30.94 30.63,30.94 U$1.15_V_ANT/RESERVED 30.48,31.09 29.87,31.09 v26.82,34.14 | v22.71,34.14 21.18,34.14 U$1.1_GND | 2.59,2.59 2.59,7.62 X1.2 | 2.59,2.59 7.62,2.59 | 2.59,2.59 X1.5 | 7.62,2.59 X1.3 | 7.62,2.59 X1.4
  Bottom 0.152: v26.82,34.14 v22.71,34.14 | v20.73,8.84 8.84,8.84 X1.3
N$14
  Top 0.203: J1.2 18.34,9.53 13.34,9.53 12.06,10.79 MAX232-SOIC16.14
N$15
  Top 0.203: R17.2 L_PWR.A
N$16
  Top 0.203: C7.1 16.73,18.41 14.61,18.41 13.34,19.68 MAX232-SOIC16.2
N$17
  Top 0.203: C8.1 14.61,23.91 MAX232-SOIC16.1
N$18
  Top 0.203: MAX232-SOIC16.3 12.06,25.4 12.91,26.25 C8.2
N$19
  Top 0.203: C9.1 10.79,23.91 MAX232-SOIC16.4
N$20
  Top 0.203: MAX232-SOIC16.5 9.53,22.86 8.89,23.5 8.89,25.4 9.74,26.25 C9.2
N$21
  Top 0.203: MAX232-SOIC16.6 8.26,23.5 7.2,24.55 C10.2
PC_RX
  Bottom 0.152: TX.3 8.84,30.48 8.84,23.47 3.2,17.83 PROGRAM.P$3
PC_TX
  Bottom 0.152: RX.3 8.99,34.9 8.99,32.46 9.91,31.55 9.91,21.95 3.2,15.24 PROGRAM.P$2
PULSE
  Top 0.152: FLIGHT-COMPUTER.32 18.14,43.28 18.14,39.47 23.32,34.29 23.32,32.61 21.79,31.09 21.18,31.09 U$1.4_TIMEPULSE
SCK-5V  (via drill 0.25)
  Top 0.152: v12.34,50.44 10.97,50.44 FLIGHT-COMPUTER.17 | v17.53,21.79 17.53,23.01 15.09,25.45 15.09,26.98 13.26,28.8 11.12,28.8 10.52,29.41 10.52,39.93 v12.8,42.22
  Bottom 0.152: 12.8,50.44 13.26,50.44 18.75,55.93 28.19,55.93 34.75,62.48 34.75,64.16 33.68,65.23 ISP.3 | 12.8,50.44 v12.34,50.44 | v17.53,21.79 24.08,15.24 24.08,13.72 R1.1 | 12.8,50.44 v12.8,42.22
SCL-3V3  (via drill 0.25)
  Top 0.152: v26.67,39.62 26.67,39.01 BNO055.19 26.82,38.86 27.13,38.56 27.89,38.56 29.11,39.78 v29.87,39.78
  Bottom 0.152: v26.67,39.62 25.6,39.62 24.69,40.54 TXS0102.P$5 | v29.87,39.78 31.24,41.15 R13.2
SCL-5V  (via drill 0.25)
  Top 0.152: v23.47,41.91 22.55,41.91 v22.25,41.6 22.1,41.6 v19.66,44.04 | v14.94,45.11 14.94,43.43 FLIGHT-COMPUTER.28
  Bottom 0.152: v23.47,41.91 24.54,41.91 TXS0102.P$8 | v22.25,41.6 22.25,38.71 21.34,37.8 19.66,37.8 18.75,38.71 R11.2 | v14.94,45.11 19.05,45.11 19.66,44.5 v19.66,44.04
SD_CS  (via drill 0.35)
  Top 0.203: SD-CARD.2 30.2,16.79 v29.21,17.78
  Bottom 0.203: R3.2 26.57,21.86 R6.2 28.21,21.95 29.21,20.95 v29.21,17.78
SD_MOSI  (via drill 0.35)
  Top 0.203: SD-CARD.3 29.39,15.69 v29.21,15.88
  Bottom 0.203: R2.2 26.57,16.78 R5.2 28.21,16.88 v29.21,15.88
SD_SCK  (via drill 0.35)
  Top 0.203: SD-CARD.5 28.73,13.49 v28.57,13.34
  Bottom 0.203: R1.2 26.13,11.7 R4.2 28.57,13.06 v28.57,13.34
SDA-3V3  (via drill 0.25)
  Top 0.152: v28.35,40.23 28.35,39.47 27.89,39.01 27.74,39.01 BNO055.20
  Bottom 0.152: 27.89,40.23 v28.35,40.23 | 27.89,40.23 27.58,40.54 TXS0102.P$4 | 27.89,40.23 27.89,39.62 24.84,36.58 24.38,36.58 22.1,34.29 22.1,33.98 22.55,33.53 26.98,33.53 31.24,37.8 31.24,38.71 R12.2
SDA-5V  (via drill 0.25)
  Top 0.152: v29.26,38.86 27.13,36.73 24.54,36.73 v18.75,42.52 18.59,42.67 18.59,44.04 17.98,44.65 16.15,44.65 15.09,45.72 14.78,45.72 14.17,45.11 14.17,43.43 FLIGHT-COMPUTER.27
  Bottom 0.152: v29.26,38.86 29.26,41 28.35,41.91 27.58,41.91 TXS0102.P$1 | v18.75,42.52 18.75,43.74 R10.2
SERVO_A
  Top 0.152: SERVO[A].3 3.81,35.97 13.87,46.02 15.24,46.02 16.31,44.96 19.51,44.96 FLIGHT-COMPUTER.1
SERVO_B  (via drill 0.25)
  Top 0.152: v7.62,56.39 14.02,56.39 17.98,52.43 17.98,51.97 FLIGHT-COMPUTER.9
  Bottom 0.152: v7.62,56.39 7.62,49.53 SERVO[B].3
SERVO_C
  Top 0.152: FLIGHT-COMPUTER.10 17.22,51.97 17.22,52.43 13.87,55.78 3.81,55.78 SERVO[C].3
SOFT_RX  (via drill 0.25)
  Top 0.152: v10.21,43.13 10.52,43.13 16.31,48.92 16.31,51.82 FLIGHT-COMPUTER.11 | v10.21,12.95 10.21,12.34 9.6,11.73 MAX232-SOIC16.12
  Bottom 0.152: v10.21,12.95 v10.21,43.13
SOFT_TX  (via drill 0.25)
  Top 0.152: v8.69,49.84 9.91,51.05 12.5,51.05 12.95,50.6 12.95,50.44 13.87,49.53 14.17,49.53 15.54,50.9 15.54,51.82 FLIGHT-COMPUTER.12 | v10.82,14.63 8.38,12.19 8.38,11.73 MAX232-SOIC16.11
  Bottom 0.152: v8.69,49.84 8.69,45.41 10.82,43.28 10.82,42.98 10.52,42.67 10.52,14.94 v10.82,14.63
SS-5V  (via drill 0.25)
  Top 0.152: v14.02,50.14 14.02,51.82 FLIGHT-COMPUTER.14
  Bottom 0.152: v14.02,50.14 14.02,40.69 24.08,30.63 24.08,23.93 R3.1
VCC  (via drill 0.25)
  Top 0.152: U$1.8_VCC 21.18,26.67 21.18,27.58 U$1.7_VCC_IO 21.18,27.74 21.18,28.65 U$1.6_V_BCKP 21.18,28.8 21.64,28.8 23.62,30.79 23.62,34.75 v19.66,38.71 | v13.11,13.56 14.78,11.89 MAX232-SOIC16.16 | 18.9,48.77 18.59,48.46 18.59,47.7 19.05,47.24 19.51,47.24 FLIGHT-COMPUTER.4 19.66,47.09 v20.57,47.09 | 18.9,48.77 19.51,48.77 FLIGHT-COMPUTER.6 | 10.06,49.23 10.06,48.46 10.36,48.16 10.82,48.16 FLIGHT-COMPUTER.20 | 10.06,49.23 10.36,49.53 10.82,49.53 FLIGHT-COMPUTER.18 | 10.06,49.23 7.92,49.23 SERVO[C].2 | 18.9,48.77 18.59,49.07 18.59,54.25 16.15,56.69 16.15,57.76 R8.1
  Top 0.203: MAX232-SOIC16.16 17.78,14.78 C7.2 | R17.1 5.99,58.42 | 1.91,53.98 1.91,56.52 3.17,57.78 5.35,57.78 5.99,58.42 | 1.91,53.98 2.54,53.34 SERVO[C].2 | 1.91,53.98 1.91,44.45 | 1.91,44.45 3.17,43.18 SERVO[B].2 | 1.91,44.45 1.91,34.29 3.17,33.02 SERVO[A].2 | R8.1 15.51,58.42 5.99,58.42 | U$1.8_VCC 17.98,26.59 R16.1
  Bottom 0.152: 20.73,43.89 23.32,41.3 23.62,41.3 23.77,41.45 24.54,41.45 TXS0102.P$7 | 20,39.05 v19.66,38.71 | 21.64,46.02 20.73,45.11 20.73,43.89 | 21.64,46.02 36.12,60.5 36.12,62.64 ISP.2 | 20.73,43.89 R10.1 | v13.11,13.56 11.73,13.56 IC1.2 | 9.95,11.87 9.91,11.89 5.79,11.89 3.66,14.02 2.59,14.02 1.98,14.63 1.98,31.09 3.81,32.92 SERVO[A].2 | v20.57,47.09 21.64,46.02
  Bottom 0.203: R10.1 19.68,42.81 19.68,39.37 20,39.05 20.32,38.73 R11.1 | IC1.2 9.95,11.87 C12.2
VIN
  Top 0.203: PWR.2 8.89,62.23 10.72,62.23 U$2.IN 12.57,60.96 C5.2
  Bottom 0.152: IC1.1 16.31,13.72 16.31,17.07 16.92,17.68 16.92,37.34 11.89,42.37 11.89,50.14 10.52,51.51 10.52,60.5 7.62,63.4 PWR.2
  Bottom 0.203: IC1.1 16.25,12.96 17.36,11.85 C11.2

### Text on the board
tNames: >By Kenneth Vorseth for UAT | Flight Computer Module